# Altium project UWB_STM32.PrjPcb
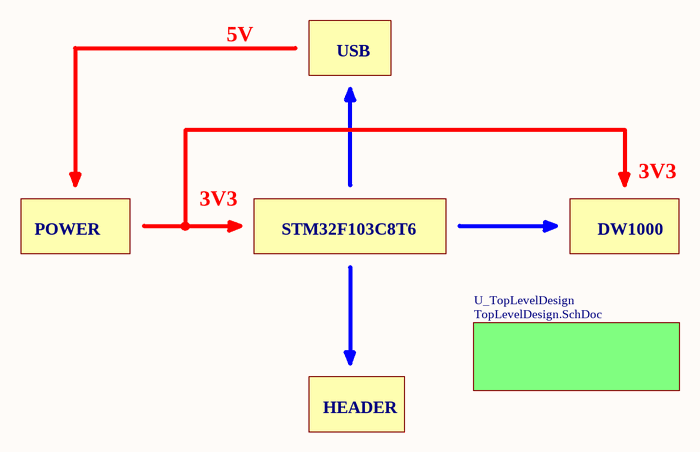
[diagram p0: BlockDiagram.SchDoc]
5 sheets, 92 parts. Net scope: flat (ports and power ports of the same name join across sheets).
Board file: UWB_STM32.PcbDoc
Sheets:
  BlockDiagram.SchDoc
    U_TopLevelDesign = TopLevelDesign.SchDoc
      U_DW1000 = DW1000.SchDoc
      U_STM32 = STM32.SchDoc
      U_POWER = POWER.SchDoc

## Sheet BlockDiagram.SchDoc
size A; SheetNumber: 1; SheetTotal: 5

### Sub-sheets
U_TopLevelDesign = TopLevelDesign.SchDoc: no entries

### Notes on the sheet
- 5V
- USB
- POWER
- 3V3
- STM32F103C8T6
- DW1000
- HEADER

## Sheet TopLevelDesign.SchDoc
size A; SheetNumber: 2; SheetTotal: 5
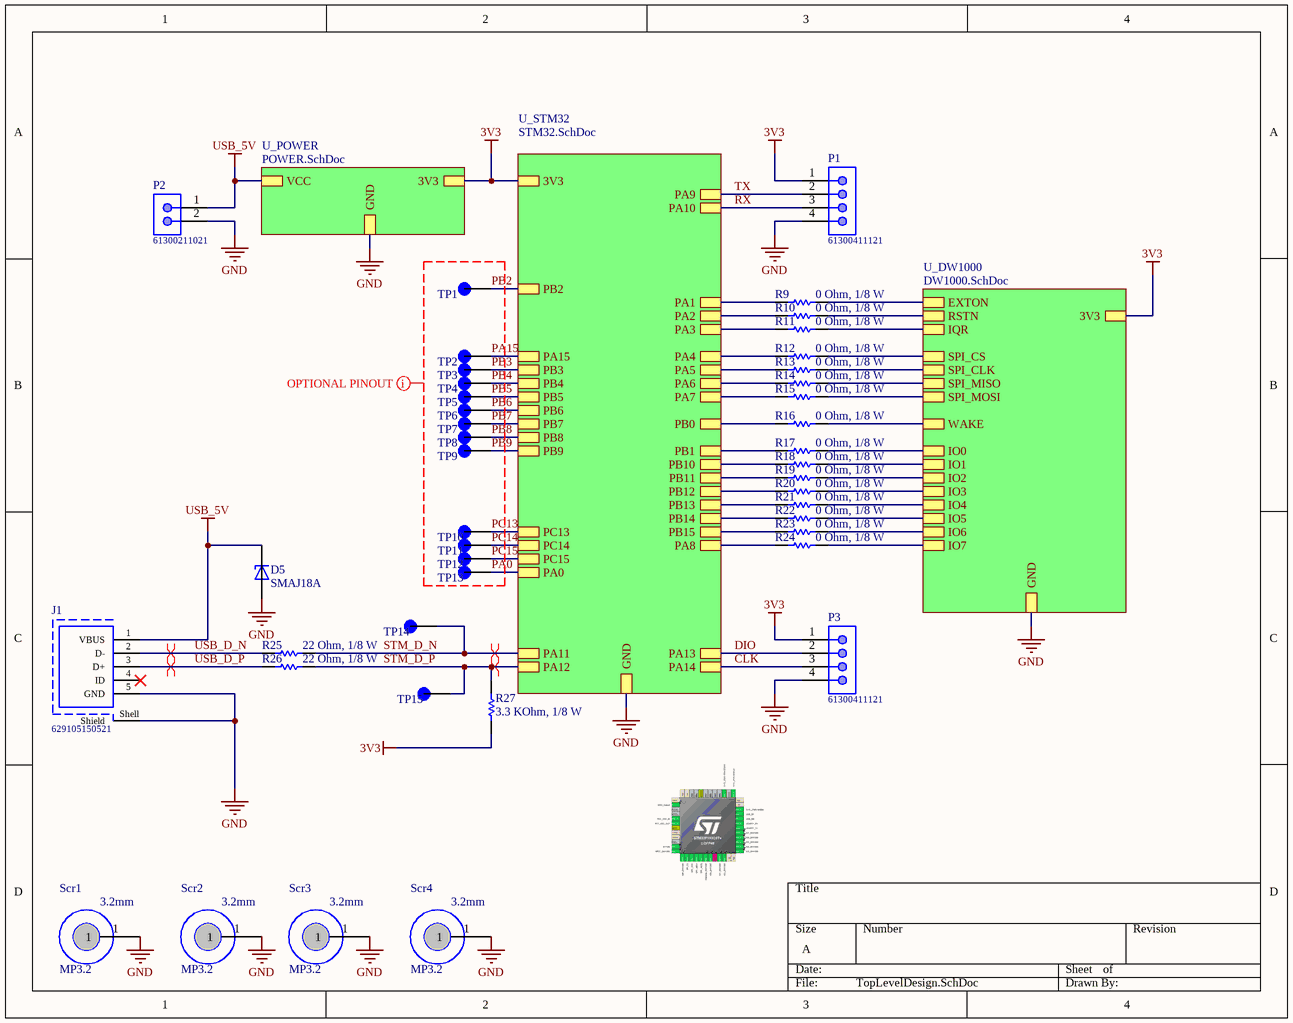
[diagram p1: TopLevelDesign.SchDoc]

### Parts
D5  SMAJ18A  [DIOM4325X250N]
J1  629105150521  [629105150521]
P1  61300411121  [61300411121]
P2  61300211021  [61300211021]
P3  61300411121  [61300411121]
R9  value 0 Ohm, 1/8 W  [RESISTOR_0805]  (hidden comment: 0008050001)
R10  value 0 Ohm, 1/8 W  [RESISTOR_0805]  (hidden comment: 0008050001)
R11  value 0 Ohm, 1/8 W  [RESISTOR_0805]  (hidden comment: 0008050001)
R12  value 0 Ohm, 1/8 W  [RESISTOR_0805]  (hidden comment: 0008050001)
R13  value 0 Ohm, 1/8 W  [RESISTOR_0805]  (hidden comment: 0008050001)
R14  value 0 Ohm, 1/8 W  [RESISTOR_0805]  (hidden comment: 0008050001)
R15  value 0 Ohm, 1/8 W  [RESISTOR_0805]  (hidden comment: 0008050001)
R16  value 0 Ohm, 1/8 W  [RESISTOR_0805]  (hidden comment: 0008050001)
R17  value 0 Ohm, 1/8 W  [RESISTOR_0805]  (hidden comment: 0008050001)
R18  value 0 Ohm, 1/8 W  [RESISTOR_0805]  (hidden comment: 0008050001)
R19  value 0 Ohm, 1/8 W  [RESISTOR_0805]  (hidden comment: 0008050001)
R20  value 0 Ohm, 1/8 W  [RESISTOR_0805]  (hidden comment: 0008050001)
R21  value 0 Ohm, 1/8 W  [RESISTOR_0805]  (hidden comment: 0008050001)
R22  value 0 Ohm, 1/8 W  [RESISTOR_0805]  (hidden comment: 0008050001)
R23  value 0 Ohm, 1/8 W  [RESISTOR_0805]  (hidden comment: 0008050001)
R24  value 0 Ohm, 1/8 W  [RESISTOR_0805]  (hidden comment: 0008050001)
R25  value 22 Ohm, 1/8 W  [RESISTOR_0805]  (hidden comment: 0008052205)
R26  value 22 Ohm, 1/8 W  [RESISTOR_0805]  (hidden comment: 0008052205)
R27  value 3.3 KOhm, 1/8 W  [RESISTOR_0805]  (hidden comment: 0008053325)
Scr1  MP3.2  [MP3.2]
Scr2  MP3.2  [MP3.2]
Scr3  MP3.2  [MP3.2]
Scr4  MP3.2  [MP3.2]
TP1  Keystone_SMD  [KEYSTONE_5019]  (value not drawn)
TP2  Keystone_SMD  [KEYSTONE_5019]  (value not drawn)
TP3  Keystone_SMD  [KEYSTONE_5019]  (value not drawn)
TP4  Keystone_SMD  [KEYSTONE_5019]  (value not drawn)
TP5  Keystone_SMD  [KEYSTONE_5019]  (value not drawn)
TP6  Keystone_SMD  [KEYSTONE_5019]  (value not drawn)
TP7  Keystone_SMD  [KEYSTONE_5019]  (value not drawn)
TP8  Keystone_SMD  [KEYSTONE_5019]  (value not drawn)
TP9  Keystone_SMD  [KEYSTONE_5019]  (value not drawn)
TP10  Keystone_SMD  [KEYSTONE_5019]  (value not drawn)
TP11  Keystone_SMD  [KEYSTONE_5019]  (value not drawn)
TP12  Keystone_SMD  [KEYSTONE_5019]  (value not drawn)
TP13  Keystone_SMD  [KEYSTONE_5019]  (value not drawn)
TP14  Keystone_SMD  [KEYSTONE_5019]  (value not drawn)
TP15  Keystone_SMD  [KEYSTONE_5019]  (value not drawn)

### Sub-sheets
U_DW1000 = DW1000.SchDoc: RSTN, IQR, SPI_CS, SPI_CLK, SPI_MOSI, SPI_MISO, EXTON, IO7, IO6, IO5, IO4, IO3, IO2, IO1, IO0, WAKE, 3V3, GND
U_POWER = POWER.SchDoc: VCC, 3V3, GND
U_STM32 = STM32.SchDoc: PB1, PB10, PB11, PB12, PB13, PB14, PB15, PA8, PA9, PA0, PA13, PA14, PA15, PA1, PA2, PA3, PA4, PA5, PA6, PA7, PB2, PB0, PB3, PB5, PB6, PB4, PB7, PA10, PA11, PB8, PB9, PA12, PC13, PC14, PC15, 3V3, GND

### Nets
3V3: P1.1 P3.1 R27.1 ; sheet U_DW1000/3V3, sheet U_STM32/3V3, sheet U_POWER/3V3
GND: D5.A J1.5(GND) J1.Shell(Shield) P1.4 P2.2 P3.4 Scr1.1 Scr2.1 Scr3.1 Scr4.1 ; sheet U_DW1000/GND, sheet U_STM32/GND, sheet U_POWER/GND
USB_5V: D5.C J1.1(VBUS) P2.1 ; sheet U_POWER/VCC
CLK: P3.3 ; sheet U_STM32/PA14
DIO: P3.2 ; sheet U_STM32/PA13
PA0: TP13.TP ; sheet U_STM32/PA0
PA15: TP2.TP ; sheet U_STM32/PA15
PB2: TP1.TP ; sheet U_STM32/PB2
PB3: TP3.TP ; sheet U_STM32/PB3
PB4: TP4.TP ; sheet U_STM32/PB4
PB5: TP5.TP ; sheet U_STM32/PB5
PB6: TP6.TP ; sheet U_STM32/PB6
PB7: TP7.TP ; sheet U_STM32/PB7
PB8: TP8.TP ; sheet U_STM32/PB8
PB9: TP9.TP ; sheet U_STM32/PB9
PC13: TP10.TP ; sheet U_STM32/PC13
PC14: TP11.TP ; sheet U_STM32/PC14
PC15: TP12.TP ; sheet U_STM32/PC15
RX: P1.3 ; sheet U_STM32/PA10
STM_D_N: R25.2 TP14.TP ; sheet U_STM32/PA11
STM_D_P: R26.2 R27.2 TP15.TP ; sheet U_STM32/PA12
TX: P1.2 ; sheet U_STM32/PA9
USB_D_N: J1.2(D-) R25.1
USB_D_P: J1.3(D+) R26.1
NetR9_1: R9.1 ; sheet U_STM32/PA1
NetR9_2: R9.2 ; sheet U_DW1000/EXTON
NetR10_1: R10.1 ; sheet U_STM32/PA2
NetR10_2: R10.2 ; sheet U_DW1000/RSTN
NetR11_1: R11.1 ; sheet U_STM32/PA3
NetR11_2: R11.2 ; sheet U_DW1000/IQR
NetR12_1: R12.1 ; sheet U_STM32/PA4
NetR12_2: R12.2 ; sheet U_DW1000/SPI_CS
NetR13_1: R13.1 ; sheet U_STM32/PA5
NetR13_2: R13.2 ; sheet U_DW1000/SPI_CLK
NetR14_1: R14.1 ; sheet U_STM32/PA6
NetR14_2: R14.2 ; sheet U_DW1000/SPI_MISO
NetR15_1: R15.1 ; sheet U_STM32/PA7
NetR15_2: R15.2 ; sheet U_DW1000/SPI_MOSI
NetR16_1: R16.1 ; sheet U_STM32/PB0
NetR16_2: R16.2 ; sheet U_DW1000/WAKE
NetR17_1: R17.1 ; sheet U_STM32/PB1
NetR17_2: R17.2 ; sheet U_DW1000/IO0
NetR18_1: R18.1 ; sheet U_STM32/PB10
NetR18_2: R18.2 ; sheet U_DW1000/IO1
NetR19_1: R19.1 ; sheet U_STM32/PB11
NetR19_2: R19.2 ; sheet U_DW1000/IO2
NetR20_1: R20.1 ; sheet U_STM32/PB12
NetR20_2: R20.2 ; sheet U_DW1000/IO3
NetR21_1: R21.1 ; sheet U_STM32/PB13
NetR21_2: R21.2 ; sheet U_DW1000/IO4
NetR22_1: R22.1 ; sheet U_STM32/PB14
NetR22_2: R22.2 ; sheet U_DW1000/IO5
NetR23_1: R23.1 ; sheet U_STM32/PB15
NetR23_2: R23.2 ; sheet U_DW1000/IO6
NetR24_1: R24.1 ; sheet U_STM32/PA8
NetR24_2: R24.2 ; sheet U_DW1000/IO7

Not connected (* = marked no-connect by the designer): J1 4(ID)*

### Layout directives
differential pair: STM_D_N, STM_D_P, USB_D_N, USB_D_P
mark named OPTIONAL PINOUT: PA0, PA15, PB2, PB3, PB4, PB5, PB6, PB7, PB8, PB9, PC13, PC14, PC15

### Notes on the sheet
- (in symbol CMP-143-000000-1) 3.2mm

### Library data of the parts
D5 = CMP-004-00085-1: 400W, 21.1V, 5%, Unidirectional, TVS; MF: Taiwan Semiconductor; SnapEDA_Link: https://www.snapeda.com/parts/SMAJ18A/taiwan/view-part/?ref=snap; Value: *; Component Type: Standard; Case/Package: SMA-2 Taiwan Semiconductor; Check_prices: https://www.snapeda.com/parts/SMAJ18A/taiwan/view-part/?ref=eda; Source: SMAJ18A.SchLib; Design Item ID: SMAJ18A; Pins: 2; MP: SMAJ18A
J1 = CMP-111-000023-1: Micro USB 2.0 Type B Receptacle WR-COM, Horizontal, SMT, with Pegs, High Current at Pin 1 & Pin 5; Contact Resistance: 30 mOhm; Rated Current: 3 A; Working Voltage: 30 VAC; ComponentLink2URL: N/A; Operating Temperature: -40 to 85 degC; Packaging: Tape and Reel; ComponentLink2Description: Supplier 1 URL; Supplier 2 URL: N/A; Source: USB Connectors WR-COM.SchLib; Supplier 1 Name: Mouser; Supplier 1 URL: https://www.mouser.vn/ProductDetail/Wurth-Elektronik/629105150521?qs=a9WhcLg8qCzXiH7kZP8GRQ%3D%3D; Value: Micro USB 2.0 Type B; ComponentLink1Description: Datasheet; ComponentLink1URL: https://katalog.we-online.de/em/datasheet/629105150521.pdf; Published Date: September 2018; Supplier 3 SN: N/A; Pin Count: 6; Connector Type: Micro USB 2.0 Type B; Design Item ID: 629105150521; Component Type: Standard; ComponentLink4URL: N/A; ComponentLink3Description: Supplier 2 URL; Supplier 2 SN: N/A; ComponentLink3URL: N/A; Orientation: Horizontal; Gender: Receptacle; ComponentLink4Description: Supplier 3 URL; Supplier 1 SN: 710-629105150521; Supplier 3 URL: N/A; Supplier 3 Name: thegioiic; Mounting Technology: SMT; Supplier 2 Name: Digi-Key; Part Number: 629105150521; Publisher: Wurth Elektronik
P1 P3 = CMP-002-00474-1: WR-PHD Pin Header, THT, pitch 2.54mm, Single Row, Vertical, 4p; Manufacturer: Wurth Elektronik; Rated Current: 3A; Contact Resistance: 20mOhm; Withstanding Voltage: 500VAC; Supply name 1: Mouser; Pin Number: 4; Working Voltage: 250VAC; Published Date: May 2020; Supplier 3 URL: N/A; Supplier 2 URL: N/A; Source: WR-PHD_Pin Header_2.54mm.SchLib; ComponentLink3Description: Global Supply; Operating Temperature: -40 to +105degC; ComponentLink1Description: Manufacturer; Component Type: Standard; ComponentLink1URL: http://www.we-online.de; ComponentLink2URL: https://www.we-online.com/catalog/datasheet/61300411121.pdf; ComponentLink2Description: Datasheet; ComponentLink4Description: Global Supply; ComponentLink4URL: https://www.mouser.vn/ProductDetail/Wurth-Elektronik/61300411121?qs=PhR8RmCirEYQcLLqXD8rAA%3D%3D; Pitch: 2.54mm; Mounting Technology: THT; Supplier 2 SN: N/A; Row Number: Single; Supplier 3 Name: thegioiic; Supplier 2 Name: Digi-Key; Supplier 1 URL: https://www.mouser.vn/ProductDetail/Wurth-Elektronik/61300311121?qs=PhR8RmCirEYxRWFJzNKsUw%3D%3D; Supplier 1 SN: 710-61300311121; Supplier 3 SN: N/A; Pins: 4; Orientation: Vertical; Gender: Pin Header; Packaging: Bag; ComponentLink3URL: https://www.we-online.com/en/components/products/PHD_2_54_THT_PIN_HEADER_6130XX11121?sq=61300411121#61300411121; Supplier 1 Name: Mouser; Design Item ID: 61300411121; Manufacturer Part Number: 61300411121
P2 = CMP-002-00465-1: WR-PHD Pin Header, THT, pitch 2.54mm, Single Row, Angled, 2p; Manufacturer: Wurth Elektronik; Contact Resistance: 20mOhm; Working Voltage: 250VAC; Supply name 1: Mouser; Pin Number: 2; Rated Current: 3A; Withstanding Voltage: 500VAC; Manufacturer Part Number: 61300211021; Supplier 3 SN: N/A; ComponentLink3Description: Global Supply; Supplier 3 URL: N/A; Supplier 1 URL: https://www.mouser.vn/ProductDetail/Wurth-Elektronik/61300211021?qs=PhR8RmCirEbDcrt4YhPPpA%3D%3D; ComponentLink3URL: https://www.we-online.com/en/components/products/PHD_2_54_THT_ANGLED_PIN_HEADER_6130XX11021?sq=61300211021#61300211021; ComponentLink1Description: Manufacturer; ComponentLink1URL: http://www.we-online.de; Pitch: 2.54mm; Supplier 1 SN: 710-61300211021; Pins: 2; Design Item ID: 61300211021; Supplier 2 SN: N/A; Operating Temperature: -40 to +105degC; Orientation: Angled; ComponentLink2URL: https://www.we-online.com/catalog/datasheet/61300211021.pdf; Component Type: Standard; Source: WR-PHD_Pin Header_2.54mm.SchLib; Supplier 2 URL: N/A; Mounting Technology: THT; Row Number: Single; ComponentLink4Description: Global Supply; ComponentLink4URL: https://www.mouser.vn/ProductDetail/Wurth-Elektronik/61300211021?qs=PhR8RmCirEbDcrt4YhPPpA%3D%3D; ComponentLink2Description: Datasheet; Supplier 3 Name: thegioiic; Supplier 2 Name: Digi-Key; Gender: Pin Header; Supplier 1 Name: Mouser; Packaging: Bag; Published Date: May 2020
R9-R24 = CMP-009-00415-1: RES, size 0805, 0 Ohm, 1/8 W; Manufacture  Name: YAGEO; Manufacture  SN: RC0805FR-070RL; Rated Power: 1/8 W; Resistance Tolerance: +/-1%; ComponentLink1URL: N/A; Component Type: Standard; Mounting Technology: SMT; Source: Resistor_0805.SchLib; ComponentLink3URL: https://www.digikey.com/en/products/detail/yageo/rc0805fr-070rl/2827620; Supplier 3 Name: Thegioiic; Size: 0805; ComponentLink1Description: Datasheet link; Design Item ID: 0008050001; ComponentLink2Description: Supplier 1 URL; Supplier 2 Name: Digi-Key; Supplier 2 SN: 311-0.0CRTR-ND; Supplier 1 URL: https://www.mouser.com/ProductDetail/YAGEO/RC0805FR-070RL?qs=fRxXYNj8ftF6kXqh1XbZJQ%3D%3D; Supplier 2 URL: https://www.digikey.com/en/products/detail/yageo/rc0805fr-070rl/2827620; ComponentLink3Description: Supplier 2 URL; Pins: 2; ComponentLink2URL: https://www.mouser.com/ProductDetail/YAGEO/RC0805FR-070RL?qs=fRxXYNj8ftF6kXqh1XbZJQ%3D%3D; Supplier 1 Name: Mouser; Supplier 3 URL: https://www.thegioiic.com/dien-tro-0-ohm-0805-1-; ComponentLink4URL: https://www.thegioiic.com/dien-tro-0-ohm-0805-1-; Supplier 1 SN: 603-RC0805FR-070RL; ComponentLink4Description: Supplier 3 URL; Supplier 3 SN: N/A
R25 R26 = CMP-009-00539-1: RES, size 0805, 22 Ohm, 1/8 W; Manufacture  Name: Bourns; Manufacture  SN: CR0805-JW-200ELF; Rated Power: 1/8 W; Resistance Tolerance: +/-5%; Component Type: Standard; ComponentLink1Description: Datasheet link; ComponentLink4Description: Supplier 3 URL; ComponentLink4URL: https://www.thegioiic.com/dien-tro-20-ohm-0805-5-; Pins: 2; ComponentLink2URL: https://www.mouser.vn/ProductDetail/Bourns/CR0805-JW-200ELF?qs=wL7NMIHXUPkPRFW4oSYkFg%3D%3D; Mounting Technology: SMT; Size: 0805; Supplier 2 SN: CHP0805-JW-200ELFTR-ND - Tape & Reel (TR); Supplier 2 URL: https://www.digikey.com/en/products/detail/bourns-inc/CHP0805-JW-200ELF/9598606; Supplier 1 URL: https://www.mouser.vn/ProductDetail/Bourns/CR0805-JW-200ELF?qs=wL7NMIHXUPkPRFW4oSYkFg%3D%3D; Supplier 2 Name: Digi-Key; ComponentLink1URL: https://www.mouser.vn/datasheet/2/54/cr-1858361.pdf; Supplier 3 Name: Thegioiic; Supplier 3 SN: N/A; ComponentLink3URL: https://www.digikey.com/en/products/detail/bourns-inc/CHP0805-JW-200ELF/9598606; Supplier 1 SN: 652-CR0805JW-200ELF; ComponentLink2Description: Supplier 1 URL; Design Item ID: 0008052205; Supplier 1 Name: Mouser; ComponentLink3Description: Supplier 2 URL; Source: Resistor_0805.SchLib; Supplier 3 URL: https://www.thegioiic.com/dien-tro-20-ohm-0805-5-
R27 = CMP-009-00577-1: RES, size 0805, 3.3 KOhm, 1/8 W; Manufacture  SN: ERJ-S06J332V; Manufacture  Name: Panasonic; Rated Power: 1/8 W; Resistance Tolerance: +/-5%; ComponentLink4Description: Supplier 3 URL; Supplier 2 SN: P3.3KATR-ND - Tape & Reel (TR); Supplier 1 SN: 667-ERJ-S06J332V; ComponentLink3Description: Supplier 2 URL; ComponentLink1URL: https://www.mouser.vn/datasheet/2/315/AOA0000C334-1314047.pdf; Supplier 3 Name: Thegioiic; Component Type: Standard; ComponentLink4URL: https://www.thegioiic.com/dien-tro-3-3-kohm-0805-5; ComponentLink3URL: https://www.digikey.com/en/products/detail/panasonic-electronic-components/ERJ-6GEYJ332V/83038; Supplier 1 Name: Mouser; Supplier 2 URL: https://www.digikey.com/en/products/detail/panasonic-electronic-components/ERJ-6GEYJ332V/83038; ComponentLink2Description: Supplier 1 URL; Pins: 2; Size: 0805; ComponentLink1Description: Datasheet link; Supplier 3 SN: N/A; Supplier 3 URL: https://www.thegioiic.com/dien-tro-3-3-kohm-0805-5; ComponentLink2URL: https://www.mouser.vn/ProductDetail/Panasonic/ERJ-S06J332V?qs=Lnc17S3XxqC89pwdWk%2FMHQ%3D%3D; Design Item ID: 0008053325; Mounting Technology: SMT; Supplier 2 Name: Digi-Key; Supplier 1 URL: https://www.mouser.vn/ProductDetail/Panasonic/ERJ-S06J332V?qs=Lnc17S3XxqC89pwdWk%2FMHQ%3D%3D; Source: Resistor_0805.SchLib
Scr1-Scr4 = CMP-143-000000-1: Component Type: Standard; Pin Count: 1; Source: MP_3P2.SchLib; Design Item ID: MP3.2
TP1-TP15 = CMP-327-000001-2: Test Point, Mini, SMT, Phos Bronze/Silver, 1000pc Tape & Reel; MF: Keystone Electronics; MP: 5019; Component Type: Standard; Value: *; Pin Count: 1; Package: NON STANDARD-1 Keystone; Design Item ID: 5019; Source: 5019.SchLib; Check_prices: https://www.snapeda.com/parts/5019/Keystone/view-part/?ref=eda; SnapEDA_Link: https://www.snapeda.com/parts/5019/Keystone/view-part/?ref=snap

## Sheet DW1000.SchDoc
size A; SheetNumber: 4; SheetTotal: 5
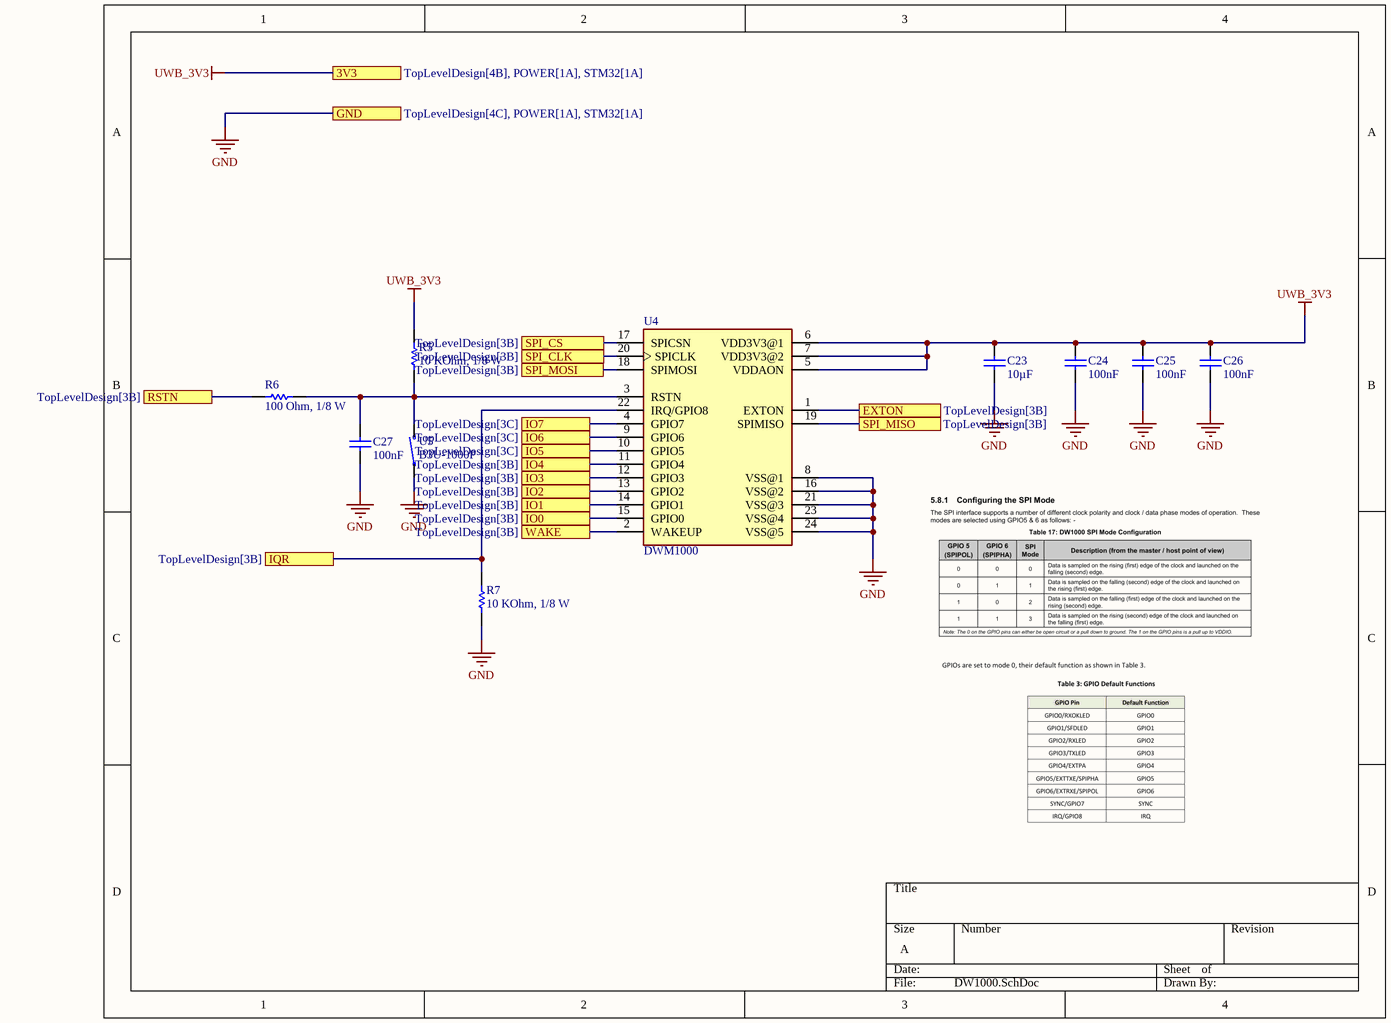
[diagram p2: DW1000.SchDoc]

### Parts
C23  value 10µF  [CAP_0805]  (hidden comment: 0108051061025)
C24  value 100nF  [CAP_0603]  (hidden comment: 0106031041050)
C25  value 100nF  [CAP_0603]  (hidden comment: 0106031041050)
C26  value 100nF  [CAP_0603]  (hidden comment: 0106031041050)
C27  value 100nF  [CAP_0603]  (hidden comment: 0106031041050)
R5  value 10 KOhm, 1/8 W  [RESISTOR_0805]  (hidden comment: 0008051035)
R6  value 100 Ohm, 1/8 W  [RESISTOR_0805]  (hidden comment: 0008051011)
R7  value 10 KOhm, 1/8 W  [RESISTOR_0805]  (hidden comment: 0008051035)
U4  DWM1000  [XCVR_DWM1000]
U5  B3U-1000P  [SODFL4025X160N]

### Ports
3V3 (see TopLevelDesign[4B], POWER[1A], STM32[1A]), EXTON (see TopLevelDesign[3B]), GND (see TopLevelDesign[4C], POWER[1A], STM32[1A]), IO0 (see TopLevelDesign[3B]), IO1 (see TopLevelDesign[3B]), IO2 (see TopLevelDesign[3B]), IO3 (see TopLevelDesign[3B]), IO4 (see TopLevelDesign[3B]), IO5 (see TopLevelDesign[3C]), IO6 (see TopLevelDesign[3C]), IO7 (see TopLevelDesign[3C]), IQR (see TopLevelDesign[3B]), RSTN (see TopLevelDesign[3B]), SPI_CLK (see TopLevelDesign[3B]), SPI_CS (see TopLevelDesign[3B]), SPI_MISO (see TopLevelDesign[3B]), SPI_MOSI (see TopLevelDesign[3B]), WAKE (see TopLevelDesign[3B])

### Nets
GND: C23.1 C24.1 C25.1 C26.1 C27.1 R7.1 U4.8(VSS@1) U4.16(VSS@2) U4.21(VSS@3) U4.23(VSS@4) U4.24(VSS@5) U5.1 ; port GND
UWB_3V3: C23.2 C24.2 C25.2 C26.2 R5.2 U4.5(VDDAON) U4.6(VDD3V3@1) U4.7(VDD3V3@2) ; port 3V3  [project net 3V3]
NetC27_2: C27.2 R5.1 R6.2 U4.3(RSTN) U5.2
NetR6_1: R6.1 ; port RSTN
NetR7_2: R7.2 U4.22(IRQ/GPIO8) ; port IQR
NetU4_1: U4.1(EXTON) ; port EXTON
NetU4_2: U4.2(WAKEUP) ; port WAKE
NetU4_4: U4.4(GPIO7) ; port IO7
NetU4_9: U4.9(GPIO6) ; port IO6
NetU4_10: U4.10(GPIO5) ; port IO5
NetU4_11: U4.11(GPIO4) ; port IO4
NetU4_12: U4.12(GPIO3) ; port IO3
NetU4_13: U4.13(GPIO2) ; port IO2
NetU4_14: U4.14(GPIO1) ; port IO1
NetU4_15: U4.15(GPIO0) ; port IO0
NetU4_17: U4.17(SPICSN) ; port SPI_CS
NetU4_18: U4.18(SPIMOSI) ; port SPI_MOSI
NetU4_19: U4.19(SPIMISO) ; port SPI_MISO
NetU4_20: U4.20(SPICLK) ; port SPI_CLK

### Library data of the parts
C23 = CMP-001-00265-1: CAP, size 0805, 10 uF, 25 VDC; Manufacture SN: CGA4J1X7S1E106K125AE; Manufacture Name: TDK; Voltage Rating DC: 25 VDC; Tolerance: 10%; Source: Capacitor_0805_10_percent.SchLib; Mounting Technology: SMT; Supplier 3 SN: OEM; Size: 0805; Design Item ID: 0108051061025; Supplier 2 SN: 445-181411-2-ND; Supplier 1 URL: https://www.mouser.vn/ProductDetail/TDK/CGA4J1X7S1E106K125AE?qs=PqoDHHvF64%252BJvhmUzM2odA%3D%3D&utm_source=mouser-refine-download&utm_medium=file&utm_campaign=CGA4J1X7S1E106K125AE&utm_content=TDK; Supplier 3 Name: thegioiic; Pins: 2; Packaging: Tape and Reel; Supplier 2 Name: Digi-Key; Operating Temperature: -55 to +125degC; Supplier 1 SN: 810-CGA4J1X7S1E106K2; Component Type: Standard; Supplier 3 URL: N/A; Supplier 1 Name: Mouser; Supplier 2 URL: https://www.digikey.com/en/products/detail/tdk-corporation/cga4j1x7s1e106k125ae/9744777
C24-C27 = CMP-001-00214-1: CAP, size 0603, 100 nF, 50 VDC; Manufacture SN: CGA3E3X8R1H104K080AE; Manufacture Name: TDK; Tolerance: 10%; Voltage Rating DC: 50 VDC; Supplier 2 Name: Digi-Key; Pins: 2; Supplier 3 Name: thegioiic; Design Item ID: 0106031041050; Supplier 1 Name: Mouser; Supplier 1 URL: https://www.mouser.com/ProductDetail/TDK/CGA3E3X8R1H104K080AE?qs=nQSIdc08i%252Bd8g3IRRgU2bw%3D%3D&utm_source=mouser-refine-download&utm_medium=file&utm_campaign=CGA3E3X8R1H104K080AE&utm_content=TDK; Size: 0603; Supplier 2 URL: https://www.digikey.com/en/products/detail/tdk-corporation/cga3e3x8r1h104k080ae/5809262; Operating Temperature: -55 to +125degC; Packaging: Tape and Reel; Source: Capacitor_0603_10_percent.SchLib; Supplier 1 SN: 810-CGA3E3X8R1H104KA; Supplier 3 SN: N/A; Supplier 2 SN: 445-173697-2-ND; Mounting Technology: SMT; Supplier 3 URL: N/A; Component Type: Standard
R5 R7 = CMP-009-00424-1: RES, size 0805, 10 KOhm, 1/8 W; Manufacture  SN: CRCW080510K0JNEAC; Manufacture  Name: Vishay Dale; Resistance Tolerance: +/-5%; Rated Power: 1/8 W; ComponentLink4URL: N/A; Supplier 3 SN: N/A; Supplier 1 SN: 71-CRCW080510K0JNEB; Source: Resistor_0805.SchLib; Supplier 3 URL: N/A; Supplier 3 Name: Thegioiic; ComponentLink2Description: Supplier 1 URL; ComponentLink4Description: Supplier 3 URL; Supplier 2 URL: https://www.digikey.com/en/products/detail/vishay-dale/CRCW080510K0JNEAC/7928585; ComponentLink3Description: Supplier 2 URL; Size: 0805; ComponentLink1Description: Datasheet link; Supplier 1 URL: https://www.mouser.vn/ProductDetail/Vishay-Dale/CRCW080510K0JNEB?qs=LOX6nxTstiZ5fn9YUdHx5A%3D%3D; Supplier 1 Name: Mouser; Pins: 2; Design Item ID: 0008051035; Supplier 2 SN: 541-4163-2-ND; Supplier 2 Name: Digi-Key; ComponentLink3URL: https://www.digikey.com/en/products/detail/vishay-dale/CRCW080510K0JNEAC/7928585; Component Type: Standard; ComponentLink2URL: https://www.mouser.vn/ProductDetail/Vishay-Dale/CRCW080510K0JNEB?qs=LOX6nxTstiZ5fn9YUdHx5A%3D%3D; Mounting Technology: SMT; ComponentLink1URL: https://www.vishay.com/docs/28773/crcwce3.pdf
R6 = CMP-009-00419-1: RES, size 0805, 100 Ohm, 1/8 W; Manufacture  SN: CRCW0805100RFKEB; Manufacture  Name: Vishay Dale Thin Film; Resistance Tolerance: +/-1%; Rated Power: 1/8 W; ComponentLink2Description: Supplier 1 URL; Size: 0805; Supplier 3 Name: Thegioiic; ComponentLink2URL: https://www.mouser.vn/ProductDetail/Vishay-Dale/CRCW0805100RFKEB?qs=sGAEpiMZZMtlubZbdhIBIKpw3Cj3Rl3MFHVHXIgVmtw%3D; ComponentLink3URL: https://www.digikey.com/en/products/detail/vpg-foil-resistors/Y1624100R000F9R/6026579; Supplier 3 URL: https://www.thegioiic.com/dien-tro-100-ohm-0805-1-; Mounting Technology: SMT; ComponentLink1URL: https://media.digikey.com/pdf/Data%20Sheets/Vishay%20Resistors/VSMP_Series_Z_Series_DS.pdf; ComponentLink1Description: Datasheet link; Supplier 2 Name: Digi-Key; Supplier 2 SN: Y1624100R000F9R-ND; Supplier 2 URL: https://www.digikey.com/en/products/detail/vpg-foil-resistors/Y1624100R000F9R/6026579; Supplier 1 Name: Mouser; Design Item ID: 0008051011; ComponentLink4Description: Supplier 3 URL; ComponentLink3Description: Supplier 2 URL; Supplier 3 SN: N/A; Supplier 1 SN: 71-CRCW0805100RFKEB; Source: Resistor_0805.SchLib; ComponentLink4URL: https://www.thegioiic.com/dien-tro-100-ohm-0805-1-; Pins: 2; Component Type: Standard; Supplier 1 URL: https://www.mouser.vn/ProductDetail/Vishay-Dale/CRCW0805100RFKEB?qs=sGAEpiMZZMtlubZbdhIBIKpw3Cj3Rl3MFHVHXIgVmtw%3D
U4 = CMP-279-000000-4: 802.15.4 IR-UWB Transceiver Module 3.5GHz ~ 6.5GHz Integrated, Chip Surface Mount; MF: Decawave Limited; Price: None; Value: *; Availability: Unavailable; Source: SnapEDAsch.SchLib; SnapEDA_Link: https://www.snapeda.com/parts/DWM1000/Decawave%20Limited/view-part/327593/?ref=snap; Component Type: Standard; Package: Module Decawave; Design Item ID: DWM1000; MP: DWM1000; Pin Count: 24
U5 = CMP-011-00123-3: Switch Tactile N.O. SPST Round Button Gull Wing 0.05A 12VDC 1.5N SMD T/R; MP: B3U1000P; MF: Omron; Design Item ID: B3U-1000P; Value: *; Component Type: Standard; Check_prices: https://www.snapeda.com/parts/B3U1000P/Omron/view-part/?ref=eda; SnapEDA_Link: https://www.snapeda.com/parts/B3U1000P/Omron/view-part/?ref=snap; Pins: 2; Case/Package: None; Source: B3U-1000P.SchLib

## Sheet STM32.SchDoc
size A; SheetNumber: 3; SheetTotal: 5
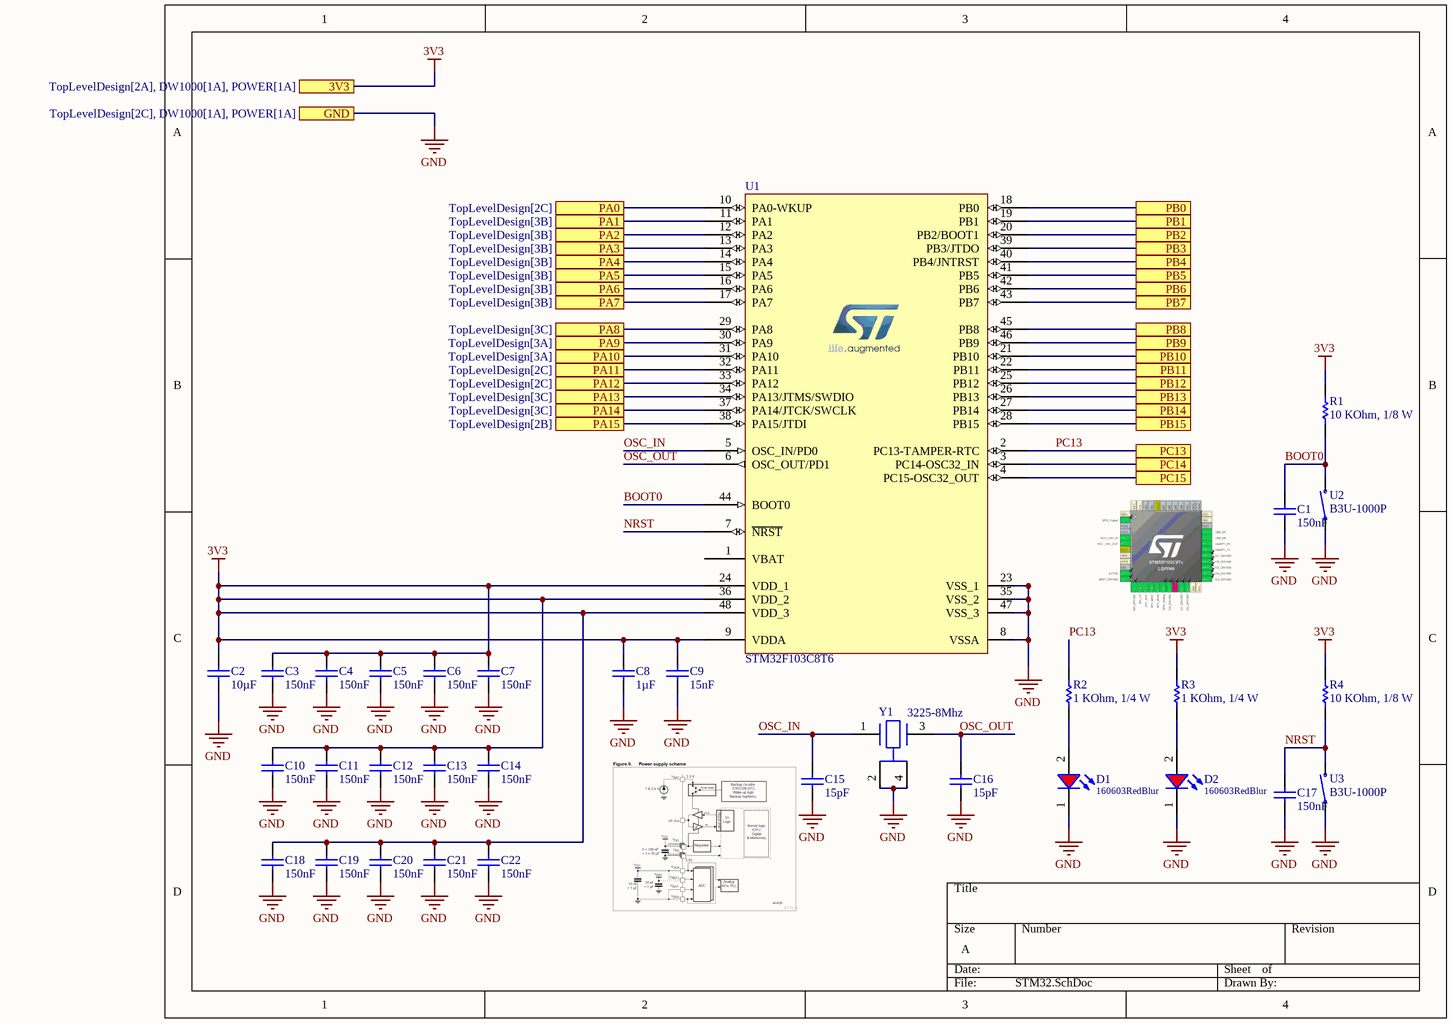
[diagram p3: STM32.SchDoc]

### Parts
C1  value 150nF  [CAP_0805]  (hidden comment: 0108051541050)
C2  value 10µF  [CAP_0805]  (hidden comment: 0108051061016)
C3  value 150nF  [CAP_0805]  (hidden comment: 0108051541050)
C4  value 150nF  [CAP_0805]  (hidden comment: 0108051541050)
C5  value 150nF  [CAP_0805]  (hidden comment: 0108051541050)
C6  value 150nF  [CAP_0805]  (hidden comment: 0108051541050)
C7  value 150nF  [CAP_0805]  (hidden comment: 0108051541050)
C8  value 1µF  [CAP_0805]  (hidden comment: 0108051051016)
C9  value 15nF  [CAP_0805]  (hidden comment: 0108051531050)
C10  value 150nF  [CAP_0805]  (hidden comment: 0108051541050)
C11  value 150nF  [CAP_0805]  (hidden comment: 0108051541050)
C12  value 150nF  [CAP_0805]  (hidden comment: 0108051541050)
C13  value 150nF  [CAP_0805]  (hidden comment: 0108051541050)
C14  value 150nF  [CAP_0805]  (hidden comment: 0108051541050)
C15  value 15pF  [CAP_0603]  (hidden comment: 0106031500550)
C16  value 15pF  [CAP_0603]  (hidden comment: 0106031500550)
C17  value 150nF  [CAP_0805]  (hidden comment: 0108051541050)
C18  value 150nF  [CAP_0805]  (hidden comment: 0108051541050)
C19  value 150nF  [CAP_0805]  (hidden comment: 0108051541050)
C20  value 150nF  [CAP_0805]  (hidden comment: 0108051541050)
C21  value 150nF  [CAP_0805]  (hidden comment: 0108051541050)
C22  value 150nF  [CAP_0805]  (hidden comment: 0108051541050)
D1  160603RedBlur  [WL-SMCW_0603_H=0.7mm]
D2  160603RedBlur  [WL-SMCW_0603_H=0.7mm]
R1  value 10 KOhm, 1/8 W  [RESISTOR_0805]  (hidden comment: 0008051035)
R2  value 1 KOhm, 1/4 W  [resistor_0603]  (hidden comment: 0006031021)
R3  value 1 KOhm, 1/4 W  [resistor_0603]  (hidden comment: 0006031021)
R4  value 10 KOhm, 1/8 W  [RESISTOR_0805]  (hidden comment: 0008051035)
U1  STM32F103C8T6  [STM32F103C8T6]
U2  B3U-1000P  [SODFL4025X160N]
U3  B3U-1000P  [SODFL4025X160N]
Y1  3225-8Mhz  [FP-NX3225SA-MFG]

### Ports
3V3 (see TopLevelDesign[2A], DW1000[1A], POWER[1A]), GND (see TopLevelDesign[2C], DW1000[1A], POWER[1A]), PA0 (see TopLevelDesign[2C]), PA1 (see TopLevelDesign[3B]), PA2 (see TopLevelDesign[3B]), PA3 (see TopLevelDesign[3B]), PA4 (see TopLevelDesign[3B]), PA5 (see TopLevelDesign[3B]), PA6 (see TopLevelDesign[3B]), PA7 (see TopLevelDesign[3B]), PA8 (see TopLevelDesign[3C]), PA9 (see TopLevelDesign[3A]), PA10 (see TopLevelDesign[3A]), PA11 (see TopLevelDesign[2C]), PA12 (see TopLevelDesign[2C]), PA13 (see TopLevelDesign[3C]), PA14 (see TopLevelDesign[3C]), PA15 (see TopLevelDesign[2B]), PB0 (see TopLevelDesign[3B]), PB1 (see TopLevelDesign[3B]), PB2 (see TopLevelDesign[2B]), PB3 (see TopLevelDesign[2B]), PB4 (see TopLevelDesign[2B]), PB5 (see TopLevelDesign[2B]), PB6 (see TopLevelDesign[2B]), PB7 (see TopLevelDesign[2B]), PB8 (see TopLevelDesign[2B]), PB9 (see TopLevelDesign[2B]), PB10 (see TopLevelDesign[3B]), PB11 (see TopLevelDesign[3B]), PB12 (see TopLevelDesign[3B]), PB13 (see TopLevelDesign[3B]), PB14 (see TopLevelDesign[3C]), PB15 (see TopLevelDesign[3C]), PC13 (see TopLevelDesign[2C]), PC14 (see TopLevelDesign[2C]), PC15 (see TopLevelDesign[2C])

### Nets
3V3: C2.2 C3.2 C4.2 C5.2 C6.2 C7.2 C8.2 C9.2 C10.2 C11.2 C12.2 C13.2 C14.2 C18.2 C19.2 C20.2 C21.2 C22.2 R1.2 R3.2 R4.2 U1.9(VDDA) U1.24(VDD_1) U1.36(VDD_2) U1.48(VDD_3) ; port 3V3
GND: C1.2 C2.1 C3.1 C4.1 C5.1 C6.1 C7.1 C8.1 C9.1 C10.1 C11.1 C12.1 C13.1 C14.1 C15.1 C16.1 C17.2 C18.1 C19.1 C20.1 C21.1 C22.1 D1.1(K) D2.1(K) U1.8(VSSA) U1.23(VSS_1) U1.35(VSS_2) U1.47(VSS_3) U2.1 U3.1 Y1.2(GND) Y1.4(GND) ; port GND
BOOT0: C1.1 R1.1 U1.44(BOOT0) U2.2
NRST: C17.1 R4.1 U1.7(~{NRST}) U3.2
OSC_IN: C15.2 U1.5(OSC_IN/PD0) Y1.1
OSC_OUT: C16.2 U1.6(OSC_OUT/PD1) Y1.3
PC13: R2.2 U1.2(PC13-TAMPER-RTC) ; port PC13
NetD1_2: D1.2(A) R2.1
NetD2_2: D2.2(A) R3.1
NetU1_3: U1.3(PC14-OSC32_IN) ; port PC14
NetU1_4: U1.4(PC15-OSC32_OUT) ; port PC15
NetU1_10: U1.10(PA0-WKUP) ; port PA0
NetU1_11: U1.11(PA1) ; port PA1
NetU1_12: U1.12(PA2) ; port PA2
NetU1_13: U1.13(PA3) ; port PA3
NetU1_14: U1.14(PA4) ; port PA4
NetU1_15: U1.15(PA5) ; port PA5
NetU1_16: U1.16(PA6) ; port PA6
NetU1_17: U1.17(PA7) ; port PA7
NetU1_18: U1.18(PB0) ; port PB0
NetU1_19: U1.19(PB1) ; port PB1
NetU1_20: U1.20(PB2/BOOT1) ; port PB2
NetU1_21: U1.21(PB10) ; port PB10
NetU1_22: U1.22(PB11) ; port PB11
NetU1_25: U1.25(PB12) ; port PB12
NetU1_26: U1.26(PB13) ; port PB13
NetU1_27: U1.27(PB14) ; port PB14
NetU1_28: U1.28(PB15) ; port PB15
NetU1_29: U1.29(PA8) ; port PA8
NetU1_30: U1.30(PA9) ; port PA9
NetU1_31: U1.31(PA10) ; port PA10
NetU1_32: U1.32(PA11) ; port PA11
NetU1_33: U1.33(PA12) ; port PA12
NetU1_34: U1.34(PA13/JTMS/SWDIO) ; port PA13
NetU1_37: U1.37(PA14/JTCK/SWCLK) ; port PA14
NetU1_38: U1.38(PA15/JTDI) ; port PA15
NetU1_39: U1.39(PB3/JTDO) ; port PB3
NetU1_40: U1.40(PB4/JNTRST) ; port PB4
NetU1_41: U1.41(PB5) ; port PB5
NetU1_42: U1.42(PB6) ; port PB6
NetU1_43: U1.43(PB7) ; port PB7
NetU1_45: U1.45(PB8) ; port PB8
NetU1_46: U1.46(PB9) ; port PB9

Not connected (* = marked no-connect by the designer): U1 1(VBAT)

### Library data of the parts
C1 C3-C7 C10-C14 C17-C22 = CMP-001-00268-1: CAP, size 0805, 150 nF, 50 VDC; Manufacture Name: TDK; Manufacture SN: CGA4J2X7R1H154K125AD; Tolerance: 10%; Voltage Rating DC: 50 VDC; Mounting Technology: SMT; Supplier 3 SN: OEM; Source: Capacitor_0805_10_percent.SchLib; Supplier 2 URL: https://www.digikey.com/en/products/detail/tdk-corporation/cga4j2x7r1h154k125ad/3933662; Size: 0805; Supplier 2 Name: Digi-Key; Supplier 2 SN: 445-9929-2-ND; Component Type: Standard; Operating Temperature: -55 to +125degC; Supplier 1 URL: https://www.mouser.vn/ProductDetail/TDK/CGA4J2X7R1H154K125AD?qs=xLDY6iXSiQYlxmVq9lRXDA%3D%3D&utm_source=mouser-refine-download&utm_medium=file&utm_campaign=CGA4J2X7R1H154K125AD&utm_content=TDK; Supplier 1 SN: 810-CGA4J2X7R1H154KD; Packaging: Tape and Reel; Supplier 3 URL: N/A; Pins: 2; Design Item ID: 0108051541050; Supplier 3 Name: thegioiic; Supplier 1 Name: Mouser
C2 = CMP-001-00264-1: CAP, size 0805, 10 uF, 16 VDC; Manufacture Name: TDK; Manufacture SN: CGA4J1X7S1C106K125AE; Tolerance: 10%; Voltage Rating DC: 16 VDC; Supplier 1 URL: https://www.mouser.vn/ProductDetail/TDK/CGA4J1X7S1C106K125AE?qs=nQSIdc08i%252Bda5YDbrVYncg%3D%3D&utm_source=mouser-refine-download&utm_medium=file&utm_campaign=CGA4J1X7S1C106K125AE&utm_content=TDK; Supplier 2 URL: https://www.digikey.com/en/products/detail/tdk-corporation/cga4j1x7s1c106k125ae/5809239; Design Item ID: 0108051061016; Supplier 1 SN: 810-CGA4J1X7S1C106KA; Mounting Technology: SMT; Supplier 3 SN: OEM; Pins: 2; Supplier 3 Name: thegioiic; Packaging: Tape and Reel; Size: 0805; Source: Capacitor_0805_10_percent.SchLib; Operating Temperature: -55 to +125degC; Supplier 2 SN: 445-173674-2-ND; Supplier 1 Name: Mouser; Supplier 3 URL: N/A; Supplier 2 Name: Digi-Key; Component Type: Standard
C8 = CMP-001-00260-1: CAP, size 0805, 1 uF, 16 VDC; Manufacture SN: CGA4J2X7R1C105K125AA; Manufacture Name: TDK; Voltage Rating DC: 16 VDC; Tolerance: 10%; Component Type: Standard; Design Item ID: 0108051051016; Supplier 3 URL: N/A; Supplier 1 SN: 810-CGA4J2X7R1C105K; Mounting Technology: SMT; Supplier 2 URL: https://www.digikey.com/en/products/detail/tdk-corporation/cga4j2x7r1c105k125aa/2443167; Source: Capacitor_0805_10_percent.SchLib; Supplier 2 SN: 445-5689-2-ND; Supplier 3 Name: thegioiic; Supplier 1 URL: https://www.mouser.vn/ProductDetail/TDK/CGA4J2X7R1C105K125AA?qs=NRhsANhppD8sFjo%252B1TQuCQ%3D%3D&utm_source=mouser-refine-download&utm_medium=file&utm_campaign=CGA4J2X7R1C105K125AA&utm_content=TDK; Supplier 2 Name: Digi-Key; Supplier 3 SN: OEM; Pins: 2; Packaging: Tape and Reel; Size: 0805; Operating Temperature: -55 to +125degC; Supplier 1 Name: Mouser
C9 = CMP-001-00267-1: CAP, size 0805, 15 nF, 50 VDC; Manufacture Name: TDK; Manufacture SN: CGA4F2NP01H153J085AA; Voltage Rating DC: 50 VDC; Tolerance: 5%; Operating Temperature: -55 to +125degC; Component Type: Standard; Supplier 2 SN: 445-12627-2-ND; Pins: 2; Supplier 2 Name: Digi-Key; Source: Capacitor_0805_5_percent.SchLib; Supplier 2 URL: https://www.digikey.com/en/products/detail/tdk-corporation/cga4f2np01h153j085aa/3949863; Design Item ID: 0108051531050; Size: 0805; Supplier 1 Name: Mouser; Mounting Technology: SMT; Supplier 3 Name: thegioiic; Supplier 3 URL: N/A; Packaging: Tape and Reel; Supplier 1 SN: 810-CGA4F2NP01H153JA; Supplier 3 SN: OEM; Supplier 1 URL: https://www.mouser.vn/ProductDetail/TDK/CGA4F2NP01H153J085AA?qs=xLDY6iXSiQbFHNeB91aULg%3D%3D&utm_source=mouser-refine-download&utm_medium=file&utm_campaign=CGA4F2NP01H153J085AA&utm_content=TDK
C15 C16 = CMP-001-00221-1: CAP, size 0603, 15 pF, 50 VDC; Manufacture SN: CGA3E2NP01H150J080AA; Manufacture Name: TDK; Tolerance: 5%; Voltage Rating DC: 50 VDC; Supplier 2 Name: Digi-Key; Supplier 2 SN: 445-12393-2-ND; Supplier 3 Name: thegioiic; Component Type: Standard; Size: 0603; Mounting Technology: SMT; Supplier 2 URL: https://www.digikey.com/en/products/detail/tdk-corporation/cga3e2np01h150j080aa/3949629; Supplier 1 Name: Mouser; Supplier 3 SN: N/A; Design Item ID: 0106031500550; Source: Capacitor_0603_5_percent.SchLib; Supplier 1 URL: https://www.mouser.com/ProductDetail/TDK/CGA3E2NP01H150J080AA?qs=xLDY6iXSiQaG7IFLqTiW9w%3D%3D&utm_source=mouser-refine-download&utm_medium=file&utm_campaign=CGA3E2NP01H150J080AA&utm_content=TDK; Operating Temperature: -55 to +125degC; Supplier 1 SN: 810-CGA3E2NP01H150JA; Supplier 3 URL: N/A; Packaging: Tape and Reel; Pins: 2
D1 D2 = CMP-004-00093-1: WL-SMCW SMT Mono-color Chip LED Blur, size 0603, Red, 2V, 140deg; Value: Red, 2V; ComponentLink2URL: https://www.mouser.vn/ProductDetail/ROHM-Semiconductor/CSL1901VW1?qs=vvQtp7zwQdNmrXZcE27xEA%3D%3D; Supplier 2 URL: https://www.digikey.com/en/products/detail/rohm-semiconductor/SML-D12U8WT86/1641799; Pins: 2; Supplier 2 Name: Digi-Key; ComponentLink1Description: Datasheet link; ComponentLink3URL: https://www.digikey.com/en/products/detail/rohm-semiconductor/SML-D12U8WT86/1641799; Supplier 1 Name: Mouser; Supplier 1 SN: 755-CSL1901VW1; Size: 0603; ComponentLink1URL: N/A; Source: WL-SMCW_0603.SchLib; ComponentLink3Description: Supplier 2 URL; Type: Blur; Design Item ID: 160603RedBlur; Component Type: Standard; ComponentLink4URL: N/A; Supplier 3 Name: ICDayRoi; Supplier 3 SN: N/A; Color: Red; Supplier 1 URL: https://www.mouser.vn/ProductDetail/ROHM-Semiconductor/CSL1901VW1?qs=vvQtp7zwQdNmrXZcE27xEA%3D%3D; Supplier 2 SN: 511-1580-2-ND; ComponentLink2Description: Supplier 1 URL; Supplier 3 URL: N/A; ComponentLink4Description: Supplier 3 URL
R1 R4 = CMP-009-00424-1: as R5 on sheet DW1000; ComponentLink4URL: N/A; Supplier 3 SN: N/A; Supplier 1 SN: 71-CRCW080510K0JNEB; Source: Resistor_0805.SchLib; Supplier 3 URL: N/A; Supplier 3 Name: Thegioiic; ComponentLink2Description: Supplier 1 URL; ComponentLink4Description: Supplier 3 URL; Supplier 2 URL: https://www.digikey.com/en/products/detail/vishay-dale/CRCW080510K0JNEAC/7928585; ComponentLink3Description: Supplier 2 URL; Size: 0805; ComponentLink1Description: Datasheet link; Supplier 1 URL: https://www.mouser.vn/ProductDetail/Vishay-Dale/CRCW080510K0JNEB?qs=LOX6nxTstiZ5fn9YUdHx5A%3D%3D; Supplier 1 Name: Mouser; Pins: 2; Design Item ID: 0008051035; Supplier 2 SN: 541-4163-2-ND; Supplier 2 Name: Digi-Key; ComponentLink3URL: https://www.digikey.com/en/products/detail/vishay-dale/CRCW080510K0JNEAC/7928585; Component Type: Standard; ComponentLink2URL: https://www.mouser.vn/ProductDetail/Vishay-Dale/CRCW080510K0JNEB?qs=LOX6nxTstiZ5fn9YUdHx5A%3D%3D; Mounting Technology: SMT; ComponentLink1URL: https://www.vishay.com/docs/28773/crcwce3.pdf
R2 R3 = CMP-009-00186-1: RES, size 0603, 1 KOhm, 1/4 W; Manufacture  SN: OEM; Rated Power: 1/4 W; Resistance Tolerance: +/-1%; Supplier 1 SN: 71-RCS06031K00FKEA; ComponentLink4Description: Supplier 3 URL; ComponentLink2Description: Supplier 1 URL; Supplier 3 SN: N/A; Supplier 2 Name: Digi-Key; ComponentLink3Description: Supplier 2 URL; Pins: 2; ComponentLink4URL: N/A; Source: Resistor_0603.SchLib; ComponentLink3URL: https://www.digikey.com/en/products/detail/yageo/SR0603FR-7T1KL/9373103; Supplier 2 SN: YAG5829TR-ND YAG5829CT-ND YAG5829DKR-ND; Supplier 2 URL: https://www.digikey.com/en/products/detail/yageo/SR0603FR-7T1KL/9373103; Supplier 1 Name: Mouser; Component Type: Standard; ComponentLink2URL: N/A; Size: 0603; Supplier 1 URL: https://www.mouser.vn/ProductDetail/Vishay-Dale/RCS06031K00FKEA?qs=sGAEpiMZZMvdGkrng054t9clqp6gtJJdzI9PGMrTQi4RTIuHToNahw%3D%3D; Supplier 3 URL: N/A; Design Item ID: 0006031021; Mounting Technology: SMT; ComponentLink1URL: https://www.yageo.com/upload/media/product/productsearch/datasheet/rchip/PYu-SR_20105_RoHS_L_10.pdf; ComponentLink1Description: Datasheet link; Supplier 3 Name: thegioiic; Manufacture  Name: OEM
U1 = STM32F103C8T6-000006-1: ARM Microcontrollers - MCU 32BIT Cortex M3 64KB 20KB RAM 2X12 ADC; Manufacture SN: STM32F103C8T6TR; Manufacturer: STM; Pad count: 48; Value: STM32F103C8T6; Pins: 48; ComponentLink1URL: https://www.mouser.com/datasheet/2/389/stm32f103c8-1851025.pdf; Supplier 3 URL: https://www.thegioiic.com/stm32f103c8t6-32-bit-arm-cortex-m3-microcontroller-72mhz-64kb-flash-48-lqfp; Supplier 1 URL: https://www.mouser.com/ProductDetail/STMicroelectronics/STM32F103C8T6?qs=bhCVus9SdFtq6kqxsU5%2FDA%3D%3D; Supplier 1 Name: Mouser; Component Type: Standard; Part Number: STM32F103C8T6; ComponentLink2URL: https://www.mouser.com/ProductDetail/STMicroelectronics/STM32F103C8T6?qs=bhCVus9SdFtq6kqxsU5%2FDA%3D%3D; Source: STM32.SchLib; Supplier 2 URL: https://www.digikey.com/en/products/detail/stmicroelectronics/stm32f103c8t6tr/2122442; Supplier 3 SN: STM32F103C8T6; Supplier 2 SN: 497-17666-2-ND; ComponentLink1Description: Datasheet; Design Item ID: STM32F103C8T6; Supplier 1 SN: 511-STM32F103C8T6; ComponentLink2Description: Supplier 1 URL; Supplier 3 Name: thegioiic; Footprint name: LQFP48; ComponentLink4Description: Supplier 3 URL; ComponentLink3URL: 497-17666-2-ND; ComponentLink3Description: Supplier 2 URL; Supplier 2 Name: Digi-Key; ComponentLink4URL: https://www.thegioiic.com/stm32f103c8t6-32-bit-arm-cortex-m3-microcontroller-72mhz-64kb-flash-48-lqfp
U2 U3 = CMP-011-00123-3: as U5 on sheet DW1000; Design Item ID: B3U-1000P; Value: *; Component Type: Standard; Check_prices: https://www.snapeda.com/parts/B3U1000P/Omron/view-part/?ref=eda; SnapEDA_Link: https://www.snapeda.com/parts/B3U1000P/Omron/view-part/?ref=snap; Pins: 2; Case/Package: None; Source: B3U-1000P.SchLib
Y1 = CMP-003-00059-1: CRYSTAL 8MHZ 8PF SMD; Manufacturer: NDK; Manufacturer Part Number: NX3225SA-25.000M-STD-CRS-2; Automotive Grade: Grade 1; Tolerance: 15ppm; Esr: 100; Series: NX3225SA; Device Class L2: Crystals / Oscillators; Temperature Range High: 125°C; Category: Crys; Height: 0.6mm; Device Class L3: Crystals; Device Class L1: Passive Components; Load Capacitance: 8pF; Octopart: https://octopart.com/nx3225sa-25.000m-std-crs-2-ndk-51374293; Automotive: Yes; Temperature: -40°C to +125°C; Component Type: Standard; Source: Components - 28.03.25 - 23.15.SchLib; Digikey Description: CRYSTAL 40MHZ 8PF SMD; Design Item ID: CMP-200220-000002-1; Temperature Range Low: -40°C; Frequency: 8MHz; Case/Package: NX3225SA; RoHS: TRUE; Pins: 4; Lead Free: Yes

## Sheet POWER.SchDoc
size A; SheetNumber: 5; SheetTotal: 5
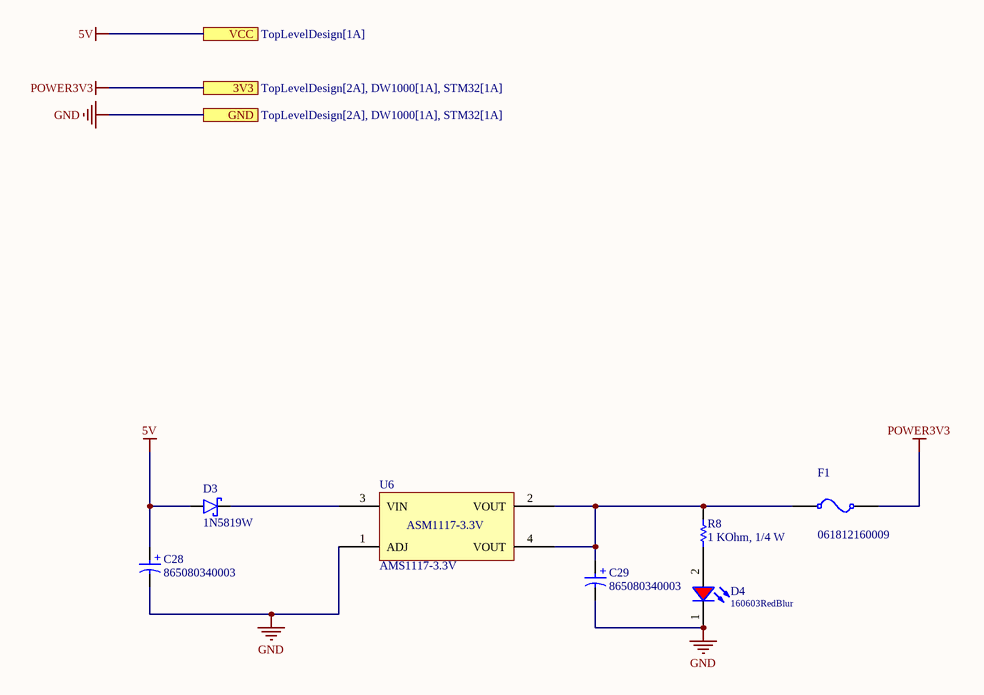
[diagram p4: POWER.SchDoc]

### Parts
C28  865080340003  [WCAP-ASLI_D4H5.5]
C29  865080340003  [WCAP-ASLI_D4H5.5]
D3  1N5819W  [1N5819W]
D4  160603RedBlur  [WL-SMCW_0603_H=0.7mm]
F1  061812160009  [Fuse_SMD_1812]
R8  value 1 KOhm, 1/4 W  [resistor_0603]  (hidden comment: 0006031021)
U6  AMS1117-3.3V  [AMS1117-3.3V SOT223]

### Ports
3V3 (see TopLevelDesign[2A], DW1000[1A], STM32[1A]), GND (see TopLevelDesign[2A], DW1000[1A], STM32[1A]), VCC (see TopLevelDesign[1A])

### Nets
5V: C28.1(P) D3.A ; port VCC
GND: C28.2(N) C29.2(N) D4.1(K) U6.1(ADJ) ; port GND
POWER3V3: F1.1 ; port 3V3  [project net 3V3]
NetC29_1: C29.1(P) F1.0 R8.2 U6.2(VOUT) U6.4(VOUT)
NetD3_K: D3.K U6.3(VIN)
NetD4_2: D4.2(A) R8.1

### Notes on the sheet
- (in symbol CMP-014-00040-1) +
- (in symbol CMP-098-000070-1) ASM1117-3.3V

### Library data of the parts
C28 C29 = CMP-014-00040-1: V-Chip, D4 x H5.5mm, 22uF, 16V; Manufacturer: Wurth Elektronik; Capacitance Tolerance: +/-20%; Leakage Current: 3.52uA; Endurance: 2000h; Ripple Current: 90mA; Dissipation Factor: 16%; Capacitance: 22µF; Height: 5.5mm; Supplier 2 Name: Digi-Key; Mount: Surface Mount; Supplier 1 URL: https://www.mouser.com/ProductDetail/Wurth-Elektronik/865080340003?qs=0KOYDY2FL2%252BowmC4S50IuQ%3D%3D; Operating Temperature Min: -55°C; Source: Al_Cap.SchLib; Component Type: Standard; Operating Temperature Max: 105°C; Supplier 2 URL: N/A; Supplier 2 SN: N/A; Supplier 1 Name: Mouser; Supplier 3 Name: thegioiic; Packaging: Tape and Reel; Supplier 3 SN: N/A; Diameter: 4mm; Supplier 3 URL: https://www.thegioiic.com/tu-nhom-smd-22uf-16v-4x5-4mm; Value: 22uF, 16V; Supplier 1 SN: 710-865080340003; Category: Aluminum Electrolytic Capacitors; Design Item ID: 865080340003; Rated Voltage (DC): 16V; Manufacturer Part Number: N/A; Pins: 2
D3 = CMP-004-00113-1: Source: 1N5819W.SchLib; Design Item ID: 1N5819W; Pins: 2; Component Type: Standard
D4 = CMP-004-00093-1: as D1 on sheet STM32; ComponentLink2URL: https://www.mouser.vn/ProductDetail/ROHM-Semiconductor/CSL1901VW1?qs=vvQtp7zwQdNmrXZcE27xEA%3D%3D; Supplier 2 URL: https://www.digikey.com/en/products/detail/rohm-semiconductor/SML-D12U8WT86/1641799; Pins: 2; Supplier 2 Name: Digi-Key; ComponentLink1Description: Datasheet link; ComponentLink3URL: https://www.digikey.com/en/products/detail/rohm-semiconductor/SML-D12U8WT86/1641799; Supplier 1 Name: Mouser; Supplier 1 SN: 755-CSL1901VW1; Size: 0603; ComponentLink1URL: N/A; Source: WL-SMCW_0603.SchLib; ComponentLink3Description: Supplier 2 URL; Type: Blur; Design Item ID: 160603RedBlur; Component Type: Standard; ComponentLink4URL: N/A; Supplier 3 Name: ICDayRoi; Supplier 3 SN: N/A; Color: Red; Supplier 1 URL: https://www.mouser.vn/ProductDetail/ROHM-Semiconductor/CSL1901VW1?qs=vvQtp7zwQdNmrXZcE27xEA%3D%3D; Supplier 2 SN: 511-1580-2-ND; ComponentLink2Description: Supplier 1 URL; Supplier 3 URL: N/A; ComponentLink4Description: Supplier 3 URL
F1 = CMP-005-00057-1: Resettable Fuse, Size 1812, 9V, 1.6A; Manufacturer: Littelfuse; Trip Current: 3.2A; Threshold Current: 100A; ComponentLink4URL: https://www.thegioiic.com/cau-chi-tu-phuc-hoi-1812-9v-1-6a; Supplier 1 URL: https://www.mouser.vn/ProductDetail/Littelfuse/miniSMDC160F-2?qs=F6FIpiMdEVaTu%252B225tqW3A%3D%3D; Supplier 2 Name: Digi-Key; ComponentLink2URL: https://www.mouser.vn/ProductDetail/Littelfuse/miniSMDC160F-2?qs=F6FIpiMdEVaTu%252B225tqW3A%3D%3D; Hold Current: 1.6A; Supplier 3 Name: thegioiic; Value: 9V, 1.6A; Source: Fuse_SMD.SchLib; Supplier 3 SN: N/A; ComponentLink3URL: https://www.digikey.com/en/products/detail/littelfuse-inc/MINISMDC160F-2/1045895?s=N4IgTCBcDaILYEsB2CDKBZAIgYQIwDYAGAMQFoIBdAXyA; ComponentLink1URL: https://www.littelfuse.com/~/media/electronics/product_specifications/resettable_ptcs/littelfuse_ptc_minismdc300f_2_product_specification.pdf.pdf; Design Item ID: 061812160009; ComponentLink1Description: Datasheet link; ComponentLink4Description: Supplier 3 URL; ComponentLink2Description: Supplier 1 URL; Mounting Technology: SMT/SMD; Supplier 1 SN: 650-MINISMDC160F-2; Size: 1812; Supplier 2 SN: MINISMDC160F-2TR-ND; Threshold Voltage: 9V; Component Type: Standard; ComponentLink3Description: Supplier 2 URL; Supplier 3 URL: https://www.thegioiic.com/cau-chi-tu-phuc-hoi-1812-9v-1-6a; Pins: 2; Supplier 2 URL: https://www.mouser.vn/ProductDetail/Littelfuse/miniSMDC160F-2?qs=F6FIpiMdEVaTu%252B225tqW3A%3D%3D; Supplier 1 Name: Mouser
R8 = CMP-009-00186-1: as R2 on sheet STM32; Supplier 1 SN: 71-RCS06031K00FKEA; ComponentLink4Description: Supplier 3 URL; ComponentLink2Description: Supplier 1 URL; Supplier 3 SN: N/A; Supplier 2 Name: Digi-Key; ComponentLink3Description: Supplier 2 URL; Pins: 2; ComponentLink4URL: N/A; Source: Resistor_0603.SchLib; ComponentLink3URL: https://www.digikey.com/en/products/detail/yageo/SR0603FR-7T1KL/9373103; Supplier 2 SN: YAG5829TR-ND YAG5829CT-ND YAG5829DKR-ND; Supplier 2 URL: https://www.digikey.com/en/products/detail/yageo/SR0603FR-7T1KL/9373103; Supplier 1 Name: Mouser; Component Type: Standard; ComponentLink2URL: N/A; Size: 0603; Supplier 1 URL: https://www.mouser.vn/ProductDetail/Vishay-Dale/RCS06031K00FKEA?qs=sGAEpiMZZMvdGkrng054t9clqp6gtJJdzI9PGMrTQi4RTIuHToNahw%3D%3D; Supplier 3 URL: N/A; Design Item ID: 0006031021; Mounting Technology: SMT; ComponentLink1URL: https://www.yageo.com/upload/media/product/productsearch/datasheet/rchip/PYu-SR_20105_RoHS_L_10.pdf; ComponentLink1Description: Datasheet link; Supplier 3 Name: thegioiic; Manufacture  Name: OEM
U6 = CMP-098-000070-1: AMS1117-3.3V, OUT 3.3V 1A.; Manufacturer: AMS; Voltage Input Maximum: 15V; Pad Count: 4; Current Output Maximum: 1A; Value: 3.3V, 1A; Supplier 2 Name: Digi-Key; Supplier 3 URL: https://www.thegioiic.com/ams1117-3-3v-ic-on-ap-3-3v-1a-sot-223; Pin Count: 4; ComponentLink2URL: N/A; ComponentLink2Description: Supplier 1 URL; ComponentLink1Description: Datasheet link; Supplier 1 Name: Mouser; Supplier 2 SN: N/A; Manufacturer Part Number: N/A; ComponentLink1URL: http://www.advanced-monolithic.com/pdf/ds1117.pdf; ComponentLink4URL: N/A; Supplier 3 SN: N/A; Supplier 3 Name: thegioiic; Supplier 2 URL: N/A; ComponentLink3URL: N/A; Supplier 1 SN: N/A; Mounting Technology: SMD; ComponentLink4Description: Supplier 3 URL; Component Type: Standard; Voltage Output: 3.3V; ComponentLink3Description: Supplier 2 URL; Design Item ID: AMS1117-3.3V; Supplier 1 URL: N/A; Current Input Maximum: N/A; Source: AMS_family.SchLib

## Nets that join several sheets
3V3: TopLevelDesign (P1.1 P3.1 R27.1), DW1000 (8 pins), STM32 (25 pins), POWER (F1.1)
GND: TopLevelDesign (10 pins), DW1000 (12 pins), STM32 (32 pins), POWER (C28.2 C29.2 D4.1 U6.1)